# EAGLE design light_brick (EAGLE 7.2.0)
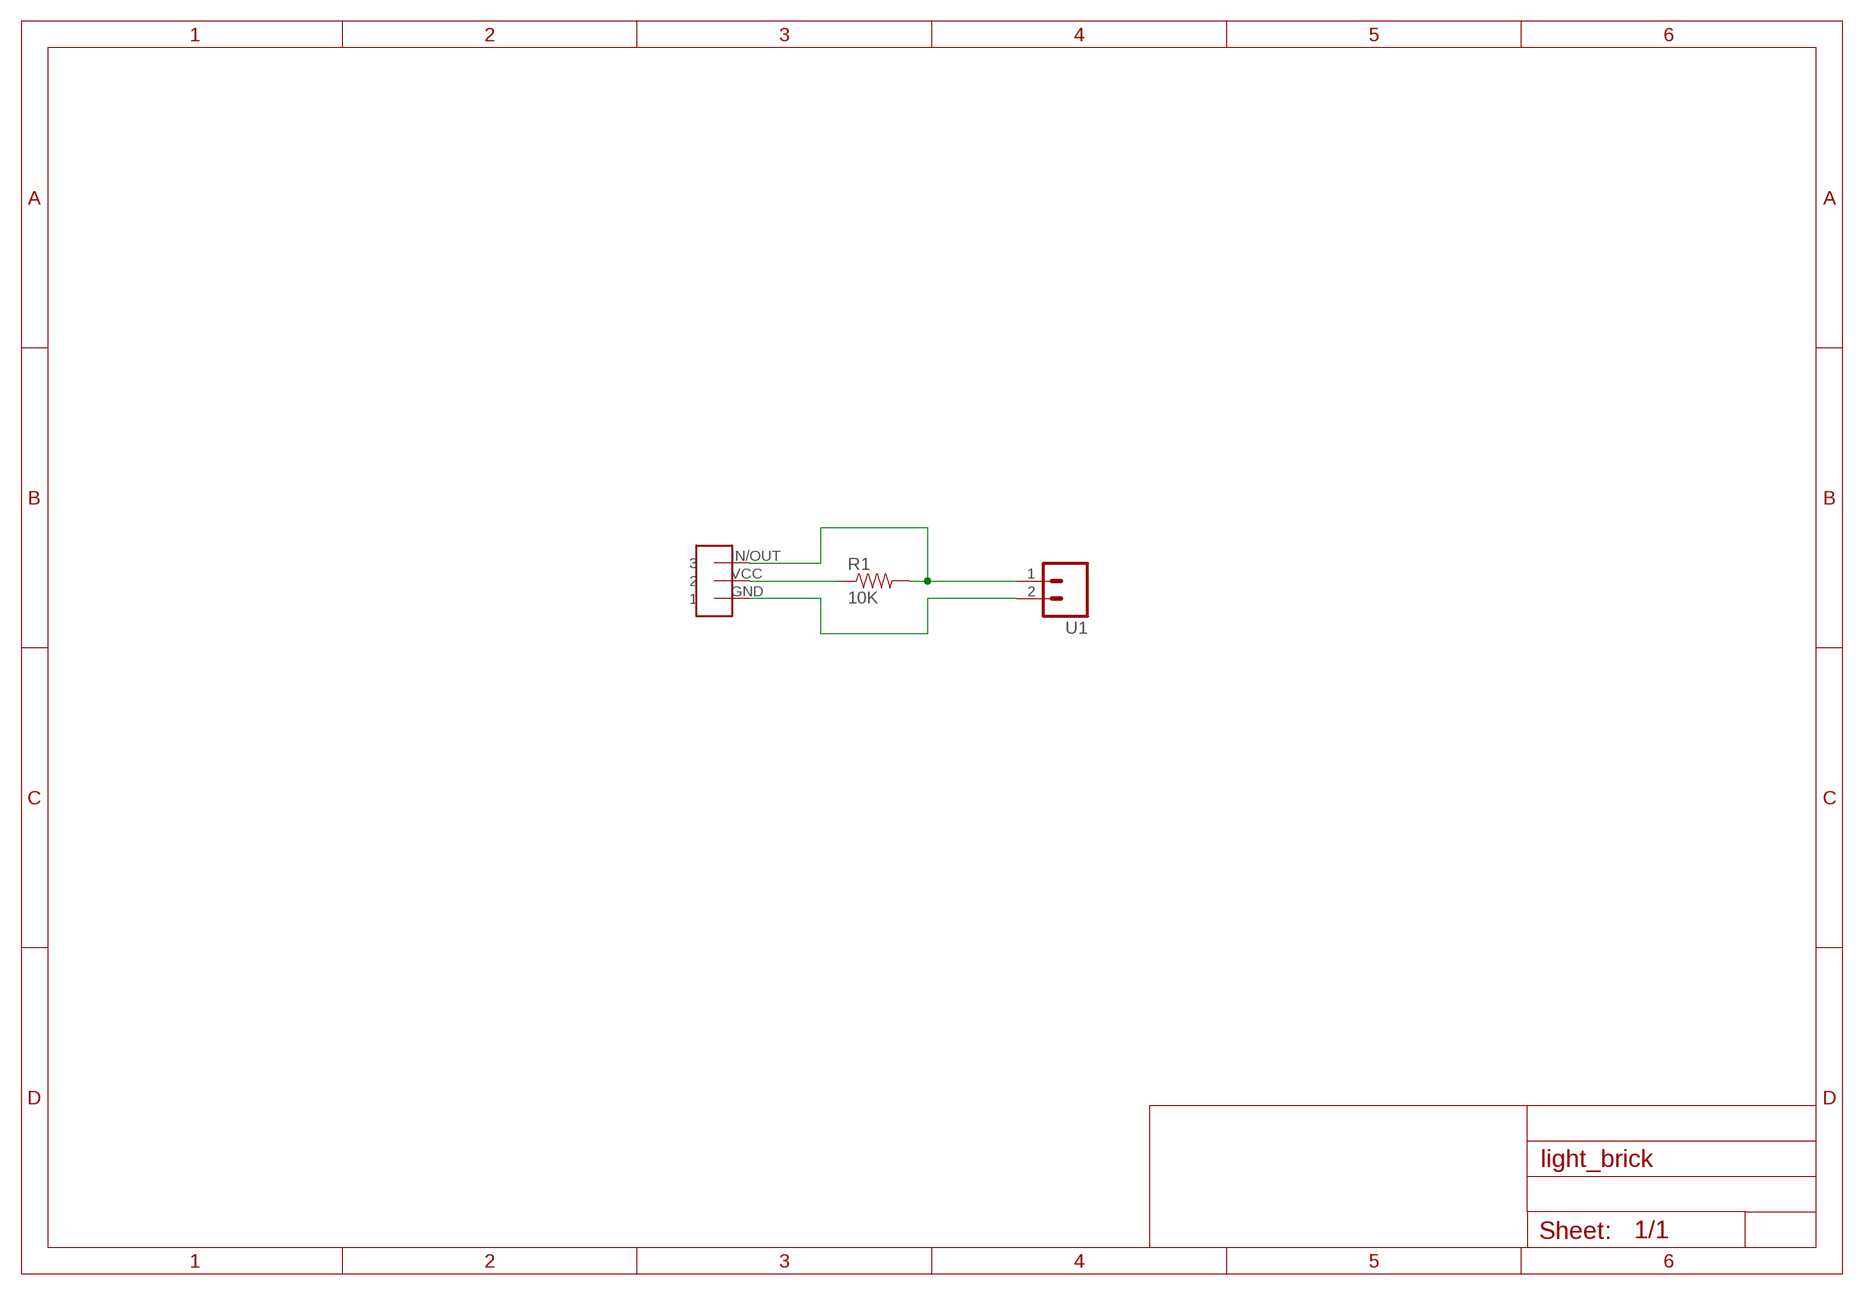
[diagram p0: schematic, sheet 1]

## Parts
R1  10K  RESISTORAXIAL-0.3  [AXIAL-0.3]
U1  M02NG  [1X02]
U$1  BRICK-3PIN  [BRICK_3PIN]

## Nets
GND: U1.2 U$1.GND
N$1: R1.P$1 U$1.VCC
N$2: R1.P$2 U1.1 U$1.IN/OUT

## Library data of the parts
R1 = SparkFun:RESISTOR: Resistor Basic schematic elements and footprints for 0603, 1206, and PTH resistors.
U1 = SparkFun:M02NG
U$1 = gclue:BRICK-3PIN

## Board
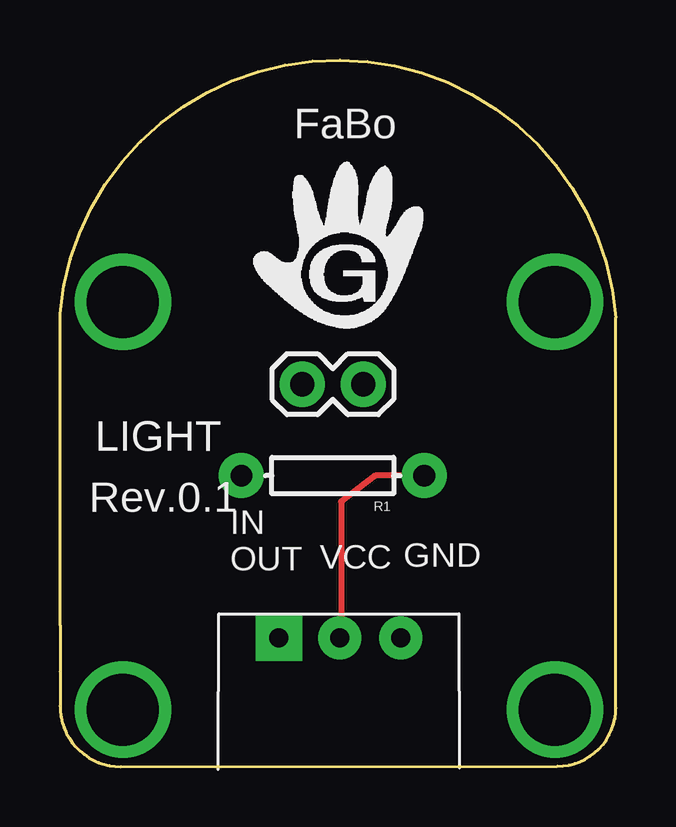
[diagram p1: board, top side]
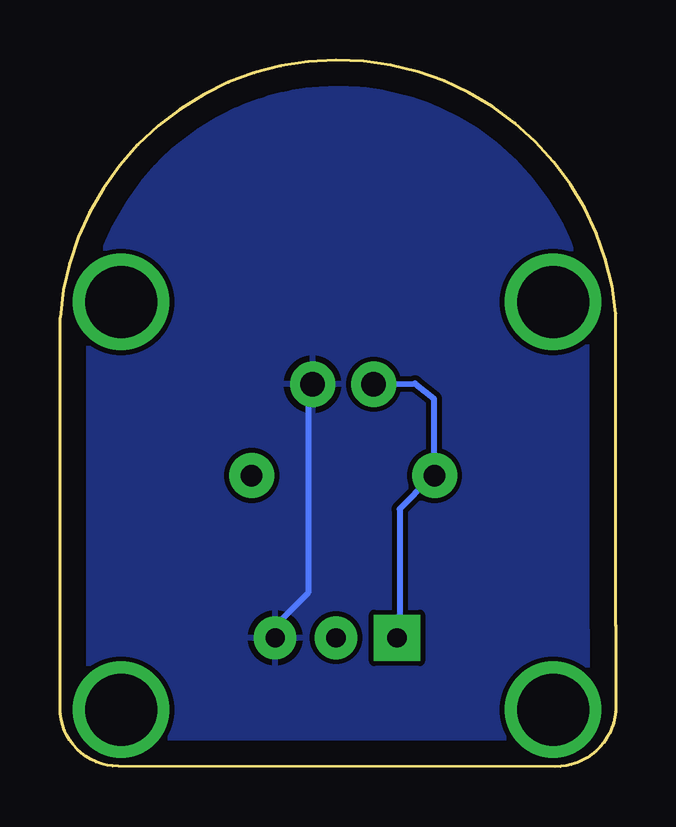
[diagram p2: board, bottom side, seen from below]

Size 23.16 x 29.47 mm. Coordinates in mm from the lower left corner, seen from the top.
Copper layers (1*16): Top 0.035mm / dielectric 1.5mm / Bottom 0.035mm
Design rules "default": minimum track width 10mil, minimum drill 24mil, track to track 8mil, track to pad 8mil, pad to pad 8mil, via to via 8mil, smd to smd 8mil, copper to edge 40mil, drill to drill 8mil, minimum pad ring 10mil, minimum via ring 8mil, stop-mask expansion 4mil, vias tented up to drill 0mil, thermal gap 10mil

### Footprints (pad centres in the part's own frame; a part is rotated, then mirrored left to right if it is on the bottom)
AXIAL-0.3 = drill 0.9 pad 1.88: P$1 -3.81,0; P$2 3.81,0
1X02 = drill 1.016 pad 1.88: 1 0,0; 2 2.54,0
BRICK_3PIN = drill 0.8 pad 1.778: GND 2.58,-6; VCC 0.04,-6 | drill 0.8 pad 1.93 square: IN/OUT -2.5,-6 | drill 3 pad 3.81: P$1 -9,8; P$2 9,8; P$3 9,-9; P$4 -9,-9

### Placement (x,y rotation side)
R1  11.37,12.14 180 top
U1  10.09,15.95 0 top
U$1  11.62,11.38 0 top

### Tracks (layer width: path | path; a pad name or v marks a point on that pad's centre or on a via)
GND
  Bottom 0.254: U1.2 12.83,15.5 12.83,7.25 14.09,5.98 14.09,6.01 U$1.GND
  pour Bottom: -0.51,-0.37 23.62,-0.37 23.62,29.79 -0.51,29.79
N$1
  Top 0.254: R1.P$1 13.14,12.14 11.71,11.06 11.71,6.01 U$1.VCC
N$2
  Bottom 0.254: U1.1 8.38,15.98 7.59,15.35 7.59,12.33 R1.P$2 7.75,12.01 9.01,10.74 9.01,6.33 U$1.IN/OUT

### Text on the board
tPlace: LIGHT | Rev.0.1